# Altium schematic sheet MCU.SchDoc: MCU
size A3; DocumentNumber: MB1167; Revision: B.1; SheetNumber: 2; SheetTotal: 17; Project: STM327x6G-EVAL
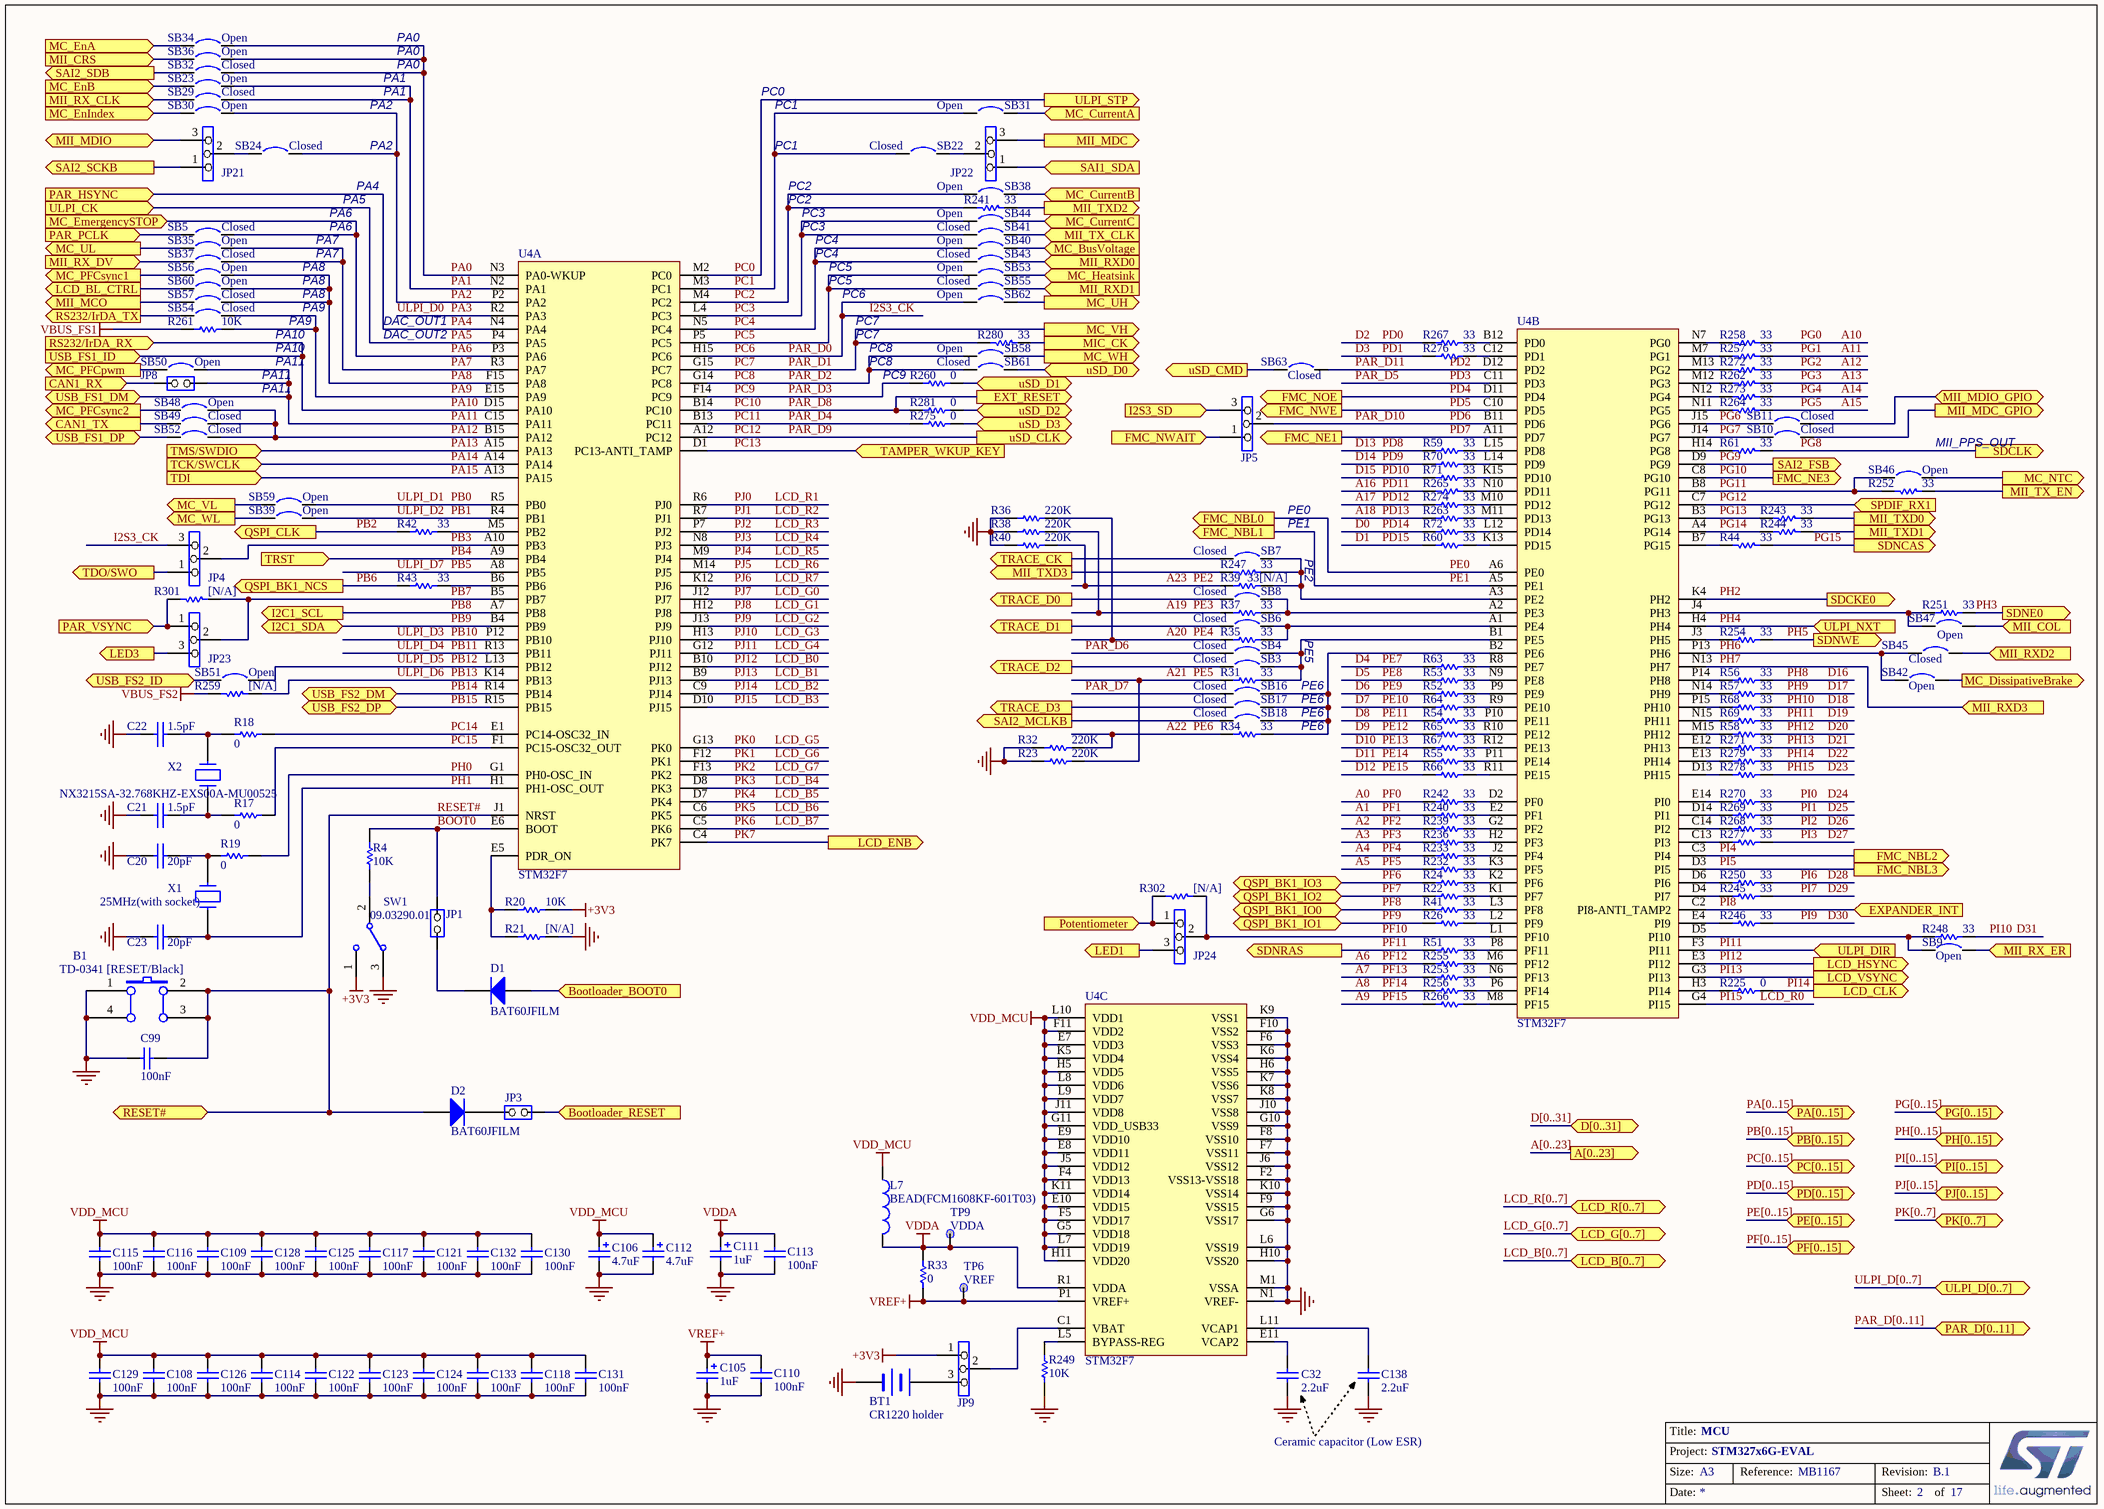
[diagram p0: MCU.SchDoc]

## Parts
B1  TD-0341 [RESET/Black]  [PB10]
BT1  CR1220 holder  [BAT_2SM_CR1220]
C20  20pF  [0603C]
C21  1.5pF  [0603C]
C22  1.5pF  [0603C]
C23  20pF  [0603C]
C32  2.2uF  [1206C]
C99  100nF  [0603C]
C105  1uF  [TAN-A]
C106  4.7uF  [TAN-A]
C108  100nF  [0402C]
C109  100nF  [0402C]
C110  100nF  [0402C]
C111  1uF  [TAN-A]
C112  4.7uF  [TAN-A]
C113  100nF  [0402C]
C114  100nF  [0402C]
C115  100nF  [0402C]
C116  100nF  [0402C]
C117  100nF  [0402C]
C118  100nF  [0402C]
C121  100nF  [0402C]
C122  100nF  [0402C]
C123  100nF  [0402C]
C124  100nF  [0402C]
C125  100nF  [0402C]
C126  100nF  [0402C]
C128  100nF  [0402C]
C129  100nF  [0402C]
C130  100nF  [0402C]
C131  100nF  [0402C]
C132  100nF  [0402C]
C133  100nF  [0402C]
C138  2.2uF  [1206C]
D1  BAT60JFILM  [SOD-323]
D2  BAT60JFILM  [SOD-323]
JP1  (no value)  [SIP2]
JP3  (no value)  [SIP2]
JP4  (no value)  [SIP3]
JP5  (no value)  [SIP3]
JP8  (no value)  [SIP2]
JP9  (no value)  [SIP3]
JP21  (no value)  [SIP3]
JP22  (no value)  [SIP3]
JP23  (no value)  [SIP3]
JP24  (no value)  [SIP3]
L7  BEAD(FCM1608KF-601T03)  [0603L]
R4  10K  [0603R]
R17  0  [0603R]
R18  0  [0603R]
R19  0  [0603R]
R20  10K  [0603R]
R21  [N/A]  [0603R]
R22  33  [0402R]
R23  220K  [0603R]
R24  33  [0402R]
R26  33  [0402R]
R31  33  [0402R]
R32  220K  [0603R]
R33  0  [0603R]
R34  33  [0402R]
R35  33  [0402R]
R36  220K  [0603R]
R37  33  [0402R]
R38  220K  [0603R]
R39  33[N/A]  [0402R]
R40  220K  [0603R]
R41  33  [0402R]
R42  33  [0402R]
R43  33  [0402R]
R44  33  [0402R]
R51  33  [0402R]
R52  33  [0402R]
R53  33  [0402R]
R54  33  [0402R]
R55  33  [0402R]
R56  33  [0402R]
R57  33  [0402R]
R58  33  [0402R]
R59  33  [0402R]
R60  33  [0402R]
R61  33  [0402R]
R63  33  [0402R]
R64  33  [0402R]
R65  33  [0402R]
R66  33  [0402R]
R67  33  [0402R]
R68  33  [0402R]
R69  33  [0402R]
R70  33  [0402R]
R71  33  [0402R]
R72  33  [0402R]
R225  0  [0603R]
R232  33  [0402R]
R233  33  [0402R]
R236  33  [0402R]
R239  33  [0402R]
R240  33  [0402R]
R241  33  [0603R]
R242  33  [0402R]
R243  33  [0603R]
R244  33  [0603R]
R245  33  [0402R]
R246  33  [0402R]
R247  33  [0603R]
R248  33  [0402R]
R249  10K  [0603R]
R250  33  [0402R]
R251  33  [0402R]
R252  33  [0603R]
R253  33  [0402R]
R254  33  [0402R]
R255  33  [0402R]
R256  33  [0402R]
R257  33  [0402R]
R258  33  [0402R]
R259  [N/A]  [0603R]
R260  0  [0603R]
R261  10K  [0603R]
R262  33  [0402R]
R263  33  [0402R]
R264  33  [0402R]
R265  33  [0402R]
R266  33  [0402R]
R267  33  [0402R]
R268  33  [0402R]
R269  33  [0402R]
R270  33  [0402R]
R271  33  [0402R]
R272  33  [0402R]
R273  33  [0402R]
R274  33  [0402R]
R275  0  [0603R]
R276  33  [0402R]
R277  33  [0402R]
R278  33  [0402R]
R279  33  [0402R]
R280  33  [0603R]
R281  0  [0603R]
R301  [N/A]  [0603R]
R302  [N/A]  [0603R]
SB3  Closed  [SB_0603]
SB4  Closed  [SB_0603]
SB5  Closed  [SB_0603]
SB6  Closed  [SB_0603]
SB7  Closed  [SB_0603]
SB8  Closed  [SB_0603]
SB9  Open  [SB_0603]
SB10  Closed  [SB_0603]
SB11  Closed  [SB_0603]
SB16  Closed  [SB_0603]
SB17  Closed  [SB_0603]
SB18  Closed  [SB_0603]
SB22  Closed  [SB_0603]
SB23  Open  [SB_0603]
SB24  Closed  [SB_0603]
SB29  Closed  [SB_0603]
SB30  Open  [SB_0603]
SB31  Open  [SB_0603]
SB32  Closed  [SB_0603]
SB34  Open  [SB_0603]
SB35  Open  [SB_0603]
SB36  Open  [SB_0603]
SB37  Closed  [SB_0603]
SB38  Open  [SB_0603]
SB39  Open  [SB_0603]
SB40  Open  [SB_0603]
SB41  Closed  [SB_0603]
SB42  Open  [SB_0603]
SB43  Closed  [SB_0603]
SB44  Open  [SB_0603]
SB45  Closed  [SB_0603]
SB46  Open  [SB_0603]
SB47  Open  [SB_0603]
SB48  Open  [SB_0603]
SB49  Closed  [SB_0603]
SB50  Open  [SB_0603]
SB51  Open  [SB_0603]
SB52  Closed  [SB_0603]
SB53  Open  [SB_0603]
SB54  Closed  [SB_0603]
SB55  Closed  [SB_0603]
SB56  Open  [SB_0603]
SB57  Closed  [SB_0603]
SB58  Open  [SB_0603]
SB59  Open  [SB_0603]
SB60  Open  [SB_0603]
SB61  Closed  [SB_0603]
SB62  Open  [SB_0603]
SB63  Closed  [SB_0603]
SW1  09.03290.01  [SW1_3TH_2R54_10X2R5]
TP6  VREF  [TP]
TP9  VDDA  [TP]
U4  STM32F7  [BGA216_0R8_13X13_SKT]  (parts A,B,C of 3)
X1  25MHz(with socket)  [XTAL_socket]
X2  NX3215SA-32.768KHZ-EXS00A-MU00525  [XTAL_2SM_3R2X1R5]

## Ports
A[0..23] (out), Bootloader_BOOT0 (in), Bootloader_RESET (in), CAN1_RX (in), CAN1_TX (out), D[0..31] (bidir), EXPANDER_INT (in), EXT_RESET (out), FMC_NBL0 (out), FMC_NBL1 (out), FMC_NBL2 (out), FMC_NBL3 (out), FMC_NE1 (out), FMC_NE3 (out), FMC_NOE (out), FMC_NWAIT (in), FMC_NWE (out), I2C1_SCL (out), I2C1_SDA (bidir), I2S3_SD (in), LCD_B[0..7] (bidir), LCD_BL_CTRL (out), LCD_CLK (out), LCD_ENB (out), LCD_G[0..7] (bidir), LCD_HSYNC (out), LCD_R[0..7] (bidir), LCD_VSYNC (out), LED1 (out), LED3 (out), MC_BusVoltage (in), MC_CurrentA (in), MC_CurrentB (in), MC_CurrentC (in), MC_DissipativeBrake (out), MC_EmergencySTOP (in), MC_EnA (in), MC_EnB (in), MC_EnIndex (in), MC_Heatsink (in), MC_NTC (out), MC_PFCpwm (out), MC_PFCsync1 (out), MC_PFCsync2 (out), MC_UH (out), MC_UL (out), MC_VH (out), MC_VL (out), MC_WH (out), MC_WL (out), MIC_CK (out), MII_COL (in), MII_CRS (in), MII_MCO (out), MII_MDC (out), MII_MDC_GPIO (out), MII_MDIO (bidir), MII_MDIO_GPIO (bidir), MII_RX_CLK (in), MII_RX_DV (in), MII_RX_ER (in), MII_RXD0 (in), MII_RXD1 (in), MII_RXD2 (in), MII_RXD3 (in), MII_TX_CLK (in), MII_TX_EN (out), MII_TXD0 (out), MII_TXD1 (out), MII_TXD2 (out), MII_TXD3 (out), PA[0..15] (bidir), PAR_D[0..11] (bidir), PAR_HSYNC (in), PAR_PCLK (in), PAR_VSYNC (in), PB[0..15] (bidir), PC[0..15] (bidir), PD[0..15] (bidir), PE[0..15] (bidir), PF[0..15] (bidir), PG[0..15] (bidir), PH[0..15] (bidir), PI[0..15] (bidir), PJ[0..15] (bidir), PK[0..7] (bidir), Potentiometer (in), QSPI_BK1_IO0 (bidir), QSPI_BK1_IO1 (bidir), QSPI_BK1_IO2 (bidir), QSPI_BK1_IO3 (bidir), QSPI_BK1_NCS (out), QSPI_CLK (out), RESET# (bidir), RS232/IrDA_RX (in), RS232/IrDA_TX (out), SAI1_SDA (in), SAI2_FSB (out), SAI2_MCLKB (out), SAI2_SCKB (out), SAI2_SDB (out), SDCKE0 (out), SDCLK (out), SDNCAS (out), SDNE0 (out), SDNRAS (out), SDNWE (out), SPDIF_RX1 (in), TAMPER_WKUP_KEY (in), TCK/SWCLK (in), TDI (in), TDO/SWO (out), TMS/SWDIO (in), TRACE_CK (out), TRACE_D0 (out), TRACE_D1 (out), TRACE_D2 (out), TRACE_D3 (out), TRST (in), ULPI_CK (in), ULPI_D[0..7] (bidir), ULPI_DIR (in), ULPI_NXT (in), ULPI_STP (out), USB_FS1_DM (bidir), USB_FS1_DP (bidir), USB_FS1_ID (in), USB_FS2_DM (bidir), USB_FS2_DP (bidir), USB_FS2_ID (bidir), uSD_CLK (out), uSD_CMD (out), uSD_D0 (bidir), uSD_D1 (bidir), uSD_D2 (bidir), uSD_D3 (bidir)

## Nets
+3V3: JP9.1 R20.2 SW1.1
GND: B1.1(A0) B1.4(A1) BT1.2(-) C20.2 C21.2 C22.2 C23.2 C32.2 C99.1 C105.2 C106.2 C108.2 C109.2 C110.1 C111.2 C112.2 C113.1 C114.2 C115.2 C116.2 C117.2 C118.2 C121.2 C122.2 C123.2 C124.2 C125.2 C126.2 C128.2 C129.2 C130.2 C131.2 C132.2 C133.2 C138.2 R21.2 R23.1 R32.1 R36.1 R38.1 R40.1 R249.1 SW1.3 U4.F2(VSS13-VSS18) U4.F6(VSS3) U4.F7(VSS11) U4.F8(VSS10) U4.F9(VSS15) U4.F10(VSS2) U4.G6(VSS17) U4.G10(VSS9) U4.H6(VSS5) U4.H10(VSS20) U4.J6(VSS12) U4.J10(VSS8) U4.K6(VSS4) U4.K7(VSS6) U4.K8(VSS7) U4.K9(VSS1) U4.K10(VSS14) U4.L6(VSS19) U4.M1(VSSA) U4.N1(VREF-)
VBUS_FS1: R261.2
VBUS_FS2: R259.1
VDD_MCU: C106.1 C108.1 C109.1 C112.1 C114.1 C115.1 C116.1 C117.1 C118.1 C121.1 C122.1 C123.1 C124.1 C125.1 C126.1 C128.1 C129.1 C130.1 C131.1 C132.1 C133.1 L7.1 U4.E7(VDD3) U4.E8(VDD11) U4.E9(VDD10) U4.E10(VDD15) U4.F4(VDD13) U4.F5(VDD17) U4.F11(VDD2) U4.G5(VDD18) U4.G11(VDD_USB33) U4.H5(VDD5) U4.H11(VDD20) U4.J5(VDD12) U4.J11(VDD8) U4.K5(VDD4) U4.K11(VDD14) U4.L7(VDD19) U4.L8(VDD6) U4.L9(VDD7) U4.L10(VDD1)
VDDA: C111.1 C113.2 L7.2 R33.1 TP9.1 U4.R1(VDDA)
VREF+: C105.1 C110.2 R33.2 TP6.1 U4.P1(VREF+)
A0: R242.2  [also labelled PF0]
A1: R240.2  [also labelled PF1]
A2: R239.2  [also labelled PF2]
A3: R236.2  [also labelled PF3]
A4: R233.2  [also labelled PF4]
A5: R232.2  [also labelled PF5]
A6: R255.2  [also labelled PF12]
A7: R253.2  [also labelled PF13]
A8: R256.2  [also labelled PF14]
A9: R266.2  [also labelled PF15]
A10: R258.2  [also labelled PG0]
A11: R257.2  [also labelled PG1]
A12: R272.2  [also labelled PG2]
A13: R262.2  [also labelled PG3]
A14: R273.2  [also labelled PG4]
A15: R264.2  [also labelled PG5]
A16: R265.1  [also labelled PD11]
A17: R274.2  [also labelled PD12]
A18: R263.2  [also labelled PD13]
A19: R37.2 R38.2  [also labelled PE3]
A20: R35.2 R36.2  [also labelled PE4]
A21: R23.2 R31.2  [also labelled PE5]
A22: R32.2 R34.2  [also labelled PE6]
A23: R39.2 R40.2  [also labelled PE2]
BOOT0: JP1.2(NO) R4.1 U4.E6(BOOT)
Bootloader_BOOT0: D1.1(A) ; port Bootloader_BOOT0
Bootloader_RESET: JP3.2(NO) ; port Bootloader_RESET
CAN1_RX: JP8.2(NO) ; port CAN1_RX
CAN1_TX: SB49.1 ; port CAN1_TX
D0: R72.2  [also labelled PD14]
D1: R60.2  [also labelled PD15]
D2: R267.2  [also labelled PD0]
D3: R276.2  [also labelled PD1]
D4: R63.2  [also labelled PE7]
D5: R53.2  [also labelled PE8]
D6: R52.2  [also labelled PE9]
D7: R64.2  [also labelled PE10]
D8: R54.2  [also labelled PE11]
D9: R65.2  [also labelled PE12]
D10: R67.2  [also labelled PE13]
D11: R55.2  [also labelled PE14]
D12: R66.2  [also labelled PE15]
D13: R59.2  [also labelled PD8]
D14: R70.2  [also labelled PD9]
D15: R71.2  [also labelled PD10]
D16: R56.1  [also labelled PH8]
D17: R57.1  [also labelled PH9]
D18: R68.1  [also labelled PH10]
D19: R69.1  [also labelled PH11]
D20: R58.1  [also labelled PH12]
D21: R271.1  [also labelled PH13]
D22: R279.1  [also labelled PH14]
D23: R278.1  [also labelled PH15]
D24: R270.1  [also labelled PI0]
D25: R269.1  [also labelled PI1]
D26: R268.1  [also labelled PI2]
D27: R277.1  [also labelled PI3]
D28: R250.1  [also labelled PI6]
D29: R245.1  [also labelled PI7]
D30: R246.1  [also labelled PI9]
D31: R248.1  [also labelled PI10]
FMC_NWAIT: JP5.1 ; port FMC_NWAIT
I2S3_CK: JP4.3 SB62.1 U4.H15(PC6)  [also labelled PAR_D0, PC6]
I2S3_SD: JP5.3 ; port I2S3_SD
LCD_B0: U4.B10(PJ12)  [also labelled PJ12]
LCD_B1: U4.B9(PJ13)  [also labelled PJ13]
LCD_B2: U4.C9(PJ14)  [also labelled PJ14]
LCD_B3: U4.D10(PJ15)  [also labelled PJ15]
LCD_B4: U4.D8(PK3)  [also labelled PK3]
LCD_B5: U4.D7(PK4)  [also labelled PK4]
LCD_B6: U4.C6(PK5)  [also labelled PK5]
LCD_B7: U4.C5(PK6)  [also labelled PK6]
LCD_BL_CTRL: SB60.1 ; port LCD_BL_CTRL
LCD_G0: U4.J12(PJ7)  [also labelled PJ7]
LCD_G1: U4.H12(PJ8)  [also labelled PJ8]
LCD_G2: U4.J13(PJ9)  [also labelled PJ9]
LCD_G3: U4.H13(PJ10)  [also labelled PJ10]
LCD_G4: U4.G12(PJ11)  [also labelled PJ11]
LCD_G5: U4.G13(PK0)  [also labelled PK0]
LCD_G6: U4.F12(PK1)  [also labelled PK1]
LCD_G7: U4.F13(PK2)  [also labelled PK2]
LCD_R0: U4.G4(PI15)  [also labelled PI15]
LCD_R1: U4.R6(PJ0)  [also labelled PJ0]
LCD_R2: U4.R7(PJ1)  [also labelled PJ1]
LCD_R3: U4.P7(PJ2)  [also labelled PJ2]
LCD_R4: U4.N8(PJ3)  [also labelled PJ3]
LCD_R5: U4.M9(PJ4)  [also labelled PJ4]
LCD_R6: U4.M14(PJ5)  [also labelled PJ5]
LCD_R7: U4.K12(PJ6)  [also labelled PJ6]
LED1: JP24.3 ; port LED1
LED3: JP23.3 ; port LED3
MC_BusVoltage: SB40.2 ; port MC_BusVoltage
MC_CurrentA: SB31.2 ; port MC_CurrentA
MC_CurrentB: SB38.2 ; port MC_CurrentB
MC_CurrentC: SB44.2 ; port MC_CurrentC
MC_DissipativeBrake: SB42.2 ; port MC_DissipativeBrake
MC_EnA: SB34.1 ; port MC_EnA
MC_EnB: SB23.1 ; port MC_EnB
MC_EnIndex: SB30.1 ; port MC_EnIndex
MC_Heatsink: SB53.2 ; port MC_Heatsink
MC_NTC: SB46.2 ; port MC_NTC
MC_PFCpwm: SB50.1 ; port MC_PFCpwm
MC_PFCsync1: SB56.1 ; port MC_PFCsync1
MC_PFCsync2: SB48.1 ; port MC_PFCsync2
MC_UH: SB62.2 ; port MC_UH
MC_UL: SB35.1 ; port MC_UL
MC_VL: SB59.1 ; port MC_VL
MC_WH: SB58.2 ; port MC_WH
MC_WL: SB39.1 ; port MC_WL
MIC_CK: R280.2 ; port MIC_CK
MII_COL: SB47.2 ; port MII_COL
MII_CRS: SB36.1 ; port MII_CRS
MII_MCO: SB57.1 ; port MII_MCO
MII_MDC: JP22.3 ; port MII_MDC
MII_MDC_GPIO: SB10.2 ; port MII_MDC_GPIO
MII_MDIO: JP21.3 ; port MII_MDIO
MII_MDIO_GPIO: SB11.2 ; port MII_MDIO_GPIO
MII_RX_CLK: SB29.1 ; port MII_RX_CLK
MII_RX_DV: SB37.1 ; port MII_RX_DV
MII_RX_ER: SB9.2 ; port MII_RX_ER
MII_RXD0: SB43.2 ; port MII_RXD0
MII_RXD1: SB55.2 ; port MII_RXD1
MII_RXD2: SB45.2 ; port MII_RXD2
MII_TX_CLK: SB41.2 ; port MII_TX_CLK
MII_TX_EN: R252.2 ; port MII_TX_EN
MII_TXD0: R243.2 ; port MII_TXD0
MII_TXD1: R244.2 ; port MII_TXD1
MII_TXD2: R241.2 ; port MII_TXD2
MII_TXD3: R247.1 ; port MII_TXD3
PA0: SB32.2 SB34.2 SB36.2 U4.N3(PA0-WKUP)
PA1: SB23.2 SB29.2 U4.N2(PA1)
PA2: SB24.2 SB30.2 U4.P2(PA2)
PA3: U4.R2(PA3)  [also labelled ULPI_D0]
PA4: U4.N4(PA4) ; port PAR_HSYNC
PA5: U4.P4(PA5) ; port ULPI_CK
PA6: SB5.2 U4.P3(PA6) ; port MC_EmergencySTOP
PA7: SB35.2 SB37.2 U4.R3(PA7)
PA8: SB56.2 SB57.2 SB60.2 U4.F15(PA8)
PA9: R261.1 SB54.2 U4.E15(PA9)
PA10: U4.D15(PA10) ; port RS232/IrDA_RX, port USB_FS1_ID
PA11: JP8.1(COMMON) SB50.2 U4.C15(PA11) ; port USB_FS1_DM
PA12: SB48.2 SB49.2 SB52.2 U4.B15(PA12)
PA13: U4.A15(PA13) ; port TMS/SWDIO
PA14: U4.A14(PA14) ; port TCK/SWCLK
PA15: U4.A13(PA15) ; port TDI
PAR_D1: R280.1 U4.G15(PC7) ; port MC_VH  [also labelled PC7]
PAR_D2: SB58.1 SB61.1 U4.G14(PC8)  [also labelled PC8]
PAR_D3: R260.2 U4.F14(PC9)  [also labelled PC9]
PAR_D4: R275.2 U4.B13(PC11)  [also labelled PC11]
PAR_D5: U4.C11(PD3)  [also labelled PD3]
PAR_D6: SB4.1
PAR_D7: SB16.1
PAR_D8: R281.2 U4.B14(PC10) ; port EXT_RESET  [also labelled PC10]
PAR_D9: U4.A12(PC12) ; port uSD_CLK  [also labelled PC12]
PAR_D10: JP5.2 U4.B11(PD6)  [also labelled PD6]
PAR_D11: SB63.2 U4.D12(PD2)  [also labelled PD2]
PAR_PCLK: SB5.1 ; port PAR_PCLK
PAR_VSYNC: JP23.1 R301.1 ; port PAR_VSYNC
PB0: SB59.2 U4.R5(PB0)  [also labelled ULPI_D1]
PB1: SB39.2 U4.R4(PB1)  [also labelled ULPI_D2]
PB2: R42.2 ; port QSPI_CLK
PB3: JP4.2 U4.A10(PB3)
PB4: U4.A9(PB4) ; port TRST
PB5: U4.A8(PB5)  [also labelled ULPI_D7]
PB6: R43.2 ; port QSPI_BK1_NCS
PB7: JP23.2 R301.2 U4.B5(PB7)
PB8: U4.A7(PB8) ; port I2C1_SCL
PB9: U4.B4(PB9) ; port I2C1_SDA
PB10: U4.P12(PB10)  [also labelled ULPI_D3]
PB11: U4.R13(PB11)  [also labelled ULPI_D4]
PB12: SB51.2 U4.L13(PB12)  [also labelled ULPI_D5]
PB13: R259.2 U4.K14(PB13)  [also labelled ULPI_D6]
PB14: U4.R14(PB14) ; port USB_FS2_DM
PB15: U4.R15(PB15) ; port USB_FS2_DP
PC0: U4.M2(PC0) ; port ULPI_STP
PC1: SB22.1 SB31.1 U4.M3(PC1)
PC2: R241.1 SB38.1 U4.M4(PC2)
PC3: SB41.1 SB44.1 U4.L4(PC3)
PC4: SB40.1 SB43.1 U4.N5(PC4)
PC5: SB53.1 SB55.1 U4.P5(PC5)
PC13: U4.D1(PC13-ANTI_TAMP) ; port TAMPER_WKUP_KEY
PC14: R18.2 U4.E1(PC14-OSC32_IN)
PC15: R17.2 U4.F1(PC15-OSC32_OUT)
PD4: U4.D11(PD4) ; port FMC_NOE
PD5: U4.C10(PD5) ; port FMC_NWE
PD7: U4.A11(PD7) ; port FMC_NE1
PE0: U4.A6(PE0) ; port FMC_NBL0
PE1: U4.A5(PE1) ; port FMC_NBL1
PF6: R24.2 ; port QSPI_BK1_IO3
PF7: R22.2 ; port QSPI_BK1_IO2
PF8: R41.2 ; port QSPI_BK1_IO0
PF9: R26.2 ; port QSPI_BK1_IO1
PF10: JP24.2 R302.2 U4.L1(PF10)
PF11: R51.2 ; port SDNRAS
PG6: SB11.1 U4.J15(PG6)
PG7: SB10.1 U4.J14(PG7)
PG8: R61.2 ; port SDCLK
PG9: U4.D9(PG9) ; port SAI2_FSB
PG10: U4.C8(PG10) ; port FMC_NE3
PG11: R252.1 SB46.1 U4.B8(PG11)
PG12: U4.C7(PG12) ; port SPDIF_RX1
PG13: R243.1 U4.B3(PG13)
PG14: R244.1 U4.A4(PG14)
PG15: R44.2 ; port SDNCAS
PH0: R19.1 U4.G1(PH0-OSC_IN)
PH1: C23.1 U4.H1(PH1-OSC_OUT) X1.1
PH2: U4.K4(PH2) ; port SDCKE0
PH3: R251.1 ; port SDNE0
PH4: U4.H4(PH4) ; port ULPI_NXT
PH5: R254.1 ; port SDNWE
PH6: SB42.1 SB45.1 U4.P13(PH6)
PH7: U4.N13(PH7) ; port MII_RXD3
PI4: U4.C3(PI4) ; port FMC_NBL2
PI5: U4.D3(PI5) ; port FMC_NBL3
PI8: U4.C2(PI8-ANTI_TAMP2) ; port EXPANDER_INT
PI11: U4.F3(PI11) ; port ULPI_DIR
PI12: U4.E3(PI12) ; port LCD_HSYNC
PI13: U4.G3(PI13) ; port LCD_VSYNC
PI14: R225.1 ; port LCD_CLK
PK7: U4.C4(PK7) ; port LCD_ENB
Potentiometer: JP24.1 R302.1 ; port Potentiometer
RESET#: B1.2(B0) B1.3(B1) C99.2 D2.1(A) U4.J1(NRST) ; port RESET#
RS232/IrDA_TX: SB54.1 ; port RS232/IrDA_TX
SAI1_SDA: JP22.1 ; port SAI1_SDA
SAI2_MCLKB: SB18.1 ; port SAI2_MCLKB
SAI2_SCKB: JP21.1 ; port SAI2_SCKB
SAI2_SDB: SB32.1 ; port SAI2_SDB
TDO/SWO: JP4.1 ; port TDO/SWO
TRACE_CK: SB7.1 ; port TRACE_CK
TRACE_D0: SB8.1 ; port TRACE_D0
TRACE_D1: SB6.1 ; port TRACE_D1
TRACE_D2: SB3.1 ; port TRACE_D2
TRACE_D3: SB17.1 ; port TRACE_D3
USB_FS1_DP: SB52.1 ; port USB_FS1_DP
USB_FS2_ID: SB51.1 ; port USB_FS2_ID
uSD_CMD: SB63.1 ; port uSD_CMD
uSD_D0: SB61.2 ; port uSD_D0
uSD_D1: R260.1 ; port uSD_D1
uSD_D2: R281.1 ; port uSD_D2
uSD_D3: R275.1 ; port uSD_D3
NetBT1_1: BT1.1(+) JP9.3
NetC20_1: C20.1 R19.2 X1.2
NetC21_1: C21.1 R17.1 X2.1
NetC22_1: C22.1 R18.1 X2.2
NetC32_1: C32.1 U4.E11(VCAP2)
NetC138_1: C138.1 U4.L11(VCAP1)
NetD1_2: D1.2(K) JP1.1(COMMON)
NetD2_2: D2.2(K) JP3.1(COMMON)
NetJP9_2: JP9.2 U4.C1(VBAT)
NetJP21_2: JP21.2 SB24.1
NetJP22_2: JP22.2 SB22.2
NetR4_2: R4.2 SW1.2
NetR20_1: R20.1 R21.1 U4.E5(PDR_ON)
NetR22_1: R22.1 U4.K1(PF7)
NetR24_1: R24.1 U4.K2(PF6)
NetR26_1: R26.1 U4.L2(PF9)
NetR31_1: R31.1 SB3.2 SB4.2 U4.B1(PE5)
NetR34_1: R34.1 SB16.2 SB17.2 SB18.2 U4.B2(PE6)
NetR35_1: R35.1 SB6.2 U4.A1(PE4)
NetR37_1: R37.1 SB8.2 U4.A2(PE3)
NetR39_1: R39.1 R247.2 SB7.2 U4.A3(PE2)
NetR41_1: R41.1 U4.L3(PF8)
NetR42_1: R42.1 U4.M5(PB2)
NetR43_1: R43.1 U4.B6(PB6)
NetR44_1: R44.1 U4.B7(PG15)
NetR51_1: R51.1 U4.P8(PF11)
NetR52_1: R52.1 U4.P9(PE9)
NetR53_1: R53.1 U4.N9(PE8)
NetR54_1: R54.1 U4.P10(PE11)
NetR55_1: R55.1 U4.P11(PE14)
NetR56_2: R56.2 U4.P14(PH8)
NetR57_2: R57.2 U4.N14(PH9)
NetR58_2: R58.2 U4.M15(PH12)
NetR59_1: R59.1 U4.L15(PD8)
NetR60_1: R60.1 U4.K13(PD15)
NetR61_1: R61.1 U4.H14(PG8)
NetR63_1: R63.1 U4.R8(PE7)
NetR64_1: R64.1 U4.R9(PE10)
NetR65_1: R65.1 U4.R10(PE12)
NetR66_1: R66.1 U4.R11(PE15)
NetR67_1: R67.1 U4.R12(PE13)
NetR68_2: R68.2 U4.P15(PH10)
NetR69_2: R69.2 U4.N15(PH11)
NetR70_1: R70.1 U4.L14(PD9)
NetR71_1: R71.1 U4.K15(PD10)
NetR72_1: R72.1 U4.L12(PD14)
NetR225_2: R225.2 U4.H3(PI14)
NetR232_1: R232.1 U4.K3(PF5)
NetR233_1: R233.1 U4.J2(PF4)
NetR236_1: R236.1 U4.H2(PF3)
NetR239_1: R239.1 U4.G2(PF2)
NetR240_1: R240.1 U4.E2(PF1)
NetR242_1: R242.1 U4.D2(PF0)
NetR245_2: R245.2 U4.D4(PI7)
NetR246_2: R246.2 U4.E4(PI9)
NetR248_2: R248.2 SB9.1 U4.D5(PI10)
NetR249_2: R249.2 U4.L5(BYPASS-REG)
NetR250_2: R250.2 U4.D6(PI6)
NetR251_2: R251.2 SB47.1 U4.J4(PH3)
NetR253_1: R253.1 U4.N6(PF13)
NetR254_2: R254.2 U4.J3(PH5)
NetR255_1: R255.1 U4.M6(PF12)
NetR256_1: R256.1 U4.P6(PF14)
NetR257_1: R257.1 U4.M7(PG1)
NetR258_1: R258.1 U4.N7(PG0)
NetR262_1: R262.1 U4.M12(PG3)
NetR263_1: R263.1 U4.M11(PD13)
NetR264_1: R264.1 U4.N11(PG5)
NetR265_2: R265.2 U4.N10(PD11)
NetR266_1: R266.1 U4.M8(PF15)
NetR267_1: R267.1 U4.B12(PD0)
NetR268_2: R268.2 U4.C14(PI2)
NetR269_2: R269.2 U4.D14(PI1)
NetR270_2: R270.2 U4.E14(PI0)
NetR271_2: R271.2 U4.E12(PH13)
NetR272_1: R272.1 U4.M13(PG2)
NetR273_1: R273.1 U4.N12(PG4)
NetR274_1: R274.1 U4.M10(PD12)
NetR276_1: R276.1 U4.C12(PD1)
NetR277_2: R277.2 U4.C13(PI3)
NetR278_2: R278.2 U4.D13(PH15)
NetR279_2: R279.2 U4.E13(PH14)

## Buses and harness runs
bus A[0..23] = port A[0..23]
bus D[0..31] = port D[0..31]
bus LCD_B[0..7] = port LCD_B[0..7]
bus LCD_G[0..7] = port LCD_G[0..7]
bus LCD_R[0..7] = port LCD_R[0..7]
bus PA[0..15] = port PA[0..15]
bus PAR_D[0..11] = port PAR_D[0..11]
bus PB[0..15] = port PB[0..15]
bus PC[0..15] = port PC[0..15]
bus PD[0..15] = port PD[0..15]
bus PE[0..15] = port PE[0..15]
bus PF[0..15] = port PF[0..15]
bus PG[0..15] = port PG[0..15]
bus PH[0..15] = port PH[0..15]
bus PI[0..15] = port PI[0..15]
bus PJ[0..15] = port PJ[0..15]
bus PK[0..7] = port PK[0..7]
bus ULPI_D[0..7] = port ULPI_D[0..7]

## Notes on the sheet
- PA0
- PA2
- PA1
- PC0
- PC1
- PA7
- PA6
- PA5
- PA4
- PC2
- PC3
- PC4
- PA8
- PA9
- PC5
- PC6
- PA11
- PA10
- DAC_OUT1
- DAC_OUT2
- PC7
- PC8
- PC9
- MII_PPS_OUT
- PE0
- PE1
- PE2
- PE5
- PE6
- Ceramic capacitor (Low ESR)
- Title:
- Project:
- Size:
- Date:
- A3
- Reference:
- Sheet:
- Revision:
- of

## Library data of the parts
B1 = SW PUSHBUTTON: SE PUSHBUTTON
BT1 = BATTERY
C20-C23 C108 C109 C114-C118 C121-C126 C128-C133 = CAP: Capacitor
  C108 C109 C114-C118 C121-C126 C128-C133: Published: 8-Jun-2000; Revision: July-2002: Re-released for DXP Platform.; Publisher: Altium Limited; Value: 100nF
C32 C110 C113 C138 = Cap: Capacitor; Value: 10nF; Published: 8-Jun-2000; Revision: July-2002: Re-released for DXP Platform.; Publisher: Altium Limited
C99 = CAP: Capacitor; Value: 100pF; Published: 8-Jun-2000; Revision: July-2002: Re-released for DXP Platform.; Publisher: Altium Limited
C105 C111 = Cap Pol1: Polarized Capacitor (Radial); Value: 10uF; Published: 8-Jun-2000; Revision: July-2002: Re-released for DXP Platform.; Publisher: Altium Limited
C106 C112 = Cap Pol1: Polarized Capacitor (Radial); Value: 47uF; Published: 8-Jun-2000; Revision: July-2002: Re-released for DXP Platform.; Publisher: Altium Limited
D1 D2 = Diode: Default Diode; Code - JEDEC: DO-214-AB; Published: 8-Jun-2000; Revision: July-2002: Re-released for DXP Platform.; Publisher: Altium Limited
JP1 JP3 JP8 = JP2
JP4 JP5 JP9 JP21-JP24 = Jumper3
L7 = Inductor: Value: 100uH; Published: 8-Jun-2000; Revision: July-2002: Re-released for DXP Platform.; Publisher: Altium Limited
R4 R23 R32 R36 R38 R40 R261 = res1: Resistor; Value: 1K; Published: 8-Jun-2000; Revision: July-2002: Re-released for DXP Platform.; Publisher: Altium Limited
R17-R22 R24 R26 R31 R33-R35 R37 R39 R41-R44 R51-R61 R63-R72 R225 R232 R233 R236 R239-R260 R262-R281 R301 R302 = Res1: Resistor; Value: 1K; Published: 8-Jun-2000; Revision: July-2002: Re-released for DXP Platform.; Publisher: Altium Limited
SB3-SB8 SB10 SB11 SB16-SB18 SB22 SB24 SB29 SB32 SB37 SB41 SB43 SB45 SB49 SB52 SB54 SB55 SB57 SB61 SB63 = Circuit Breaker_close: Circuit Breaker; Published: 24-Mar-1999; Revision: July-2002: Re-released for DXP Platform.; Publisher: Altium Limited
SB9 SB23 SB30 SB31 SB34-SB36 SB38-SB40 SB42 SB44 SB46-SB48 SB50 SB51 SB53 SB56 SB58-SB60 SB62 = Circuit Breaker: Published: 24-Mar-1999; Revision: July-2002: Re-released for DXP Platform.; Publisher: Altium Limited
SW1 = SW-SPDT: SPDT Subminiature Toggle Switch, Right Angle Mounting, Vertical Actuation; Revision 1: Jul-2002: Re-released for DXP Platform.; Revision 2: 17-Dec-2003: Schematic revised, PCB Footprint replaced.; Published: 24-Mar-1999; Datasheet: Latest Revision: 05-Dec-2000; Publisher: Altium Limited
TP6 TP9 = TP
U4 = STM32F7_TFBGA216
X1 = CRYSTAL
X2 = CRYSTAL_32K: Crystal